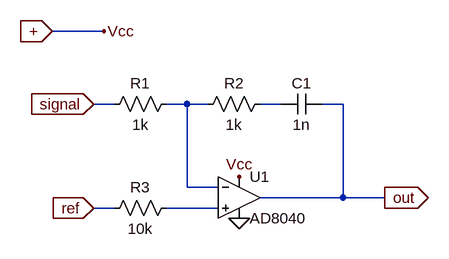
[diagram p0: schematic pi-ctrl.asc]
pi-ctrl.asc, the LTspice schematic file:
Version 4
SHEET 1 880 680
WIRE -96 -144 -176 -144
WIRE -80 -32 -112 -32
WIRE 32 -32 0 -32
WIRE 64 -32 32 -32
WIRE 176 -32 144 -32
WIRE 272 -32 240 -32
WIRE 32 96 32 -32
WIRE 80 96 32 96
WIRE 272 112 272 -32
WIRE 272 112 144 112
WIRE 336 112 272 112
WIRE -80 128 -112 128
WIRE 80 128 0 128
FLAG 336 112 out
IOPIN 336 112 Out
FLAG 112 80 Vcc
FLAG -112 -32 signal
IOPIN -112 -32 In
FLAG 112 144 0
FLAG -112 128 ref
IOPIN -112 128 In
FLAG -96 -144 Vcc
FLAG -176 -144 +
IOPIN -176 -144 In
SYMBOL res 16 -48 R90
WINDOW 0 0 56 VBottom 2
WINDOW 3 32 56 VTop 2
SYMATTR InstName R1
SYMATTR Value 1k
SYMBOL res 160 -48 R90
WINDOW 0 0 56 VBottom 2
WINDOW 3 32 56 VTop 2
SYMATTR InstName R2
SYMATTR Value 1k
SYMBOL cap 240 -48 R90
WINDOW 0 0 32 VBottom 2
WINDOW 3 32 32 VTop 2
SYMATTR InstName C1
SYMATTR Value 1n
SYMBOL Opamps\\AD8040 112 48 R0
SYMATTR InstName U1
SYMBOL res 16 112 R90
WINDOW 0 0 56 VBottom 2
WINDOW 3 32 56 VTop 2
SYMATTR InstName R3
SYMATTR Value 10k

The netlist it stands for:
* pi-ctrl.asc
R1 N001 signal 1k
R2 N002 N001 1k
C1 out N002 1n
XU1 N003 N001 + 0 out AD8040  ; pins In+ In- V+ V- OUT
R3 N003 ref 10k
.backanno
.end